# EAGLE design TFTbarebones (EAGLE 9.6.2)
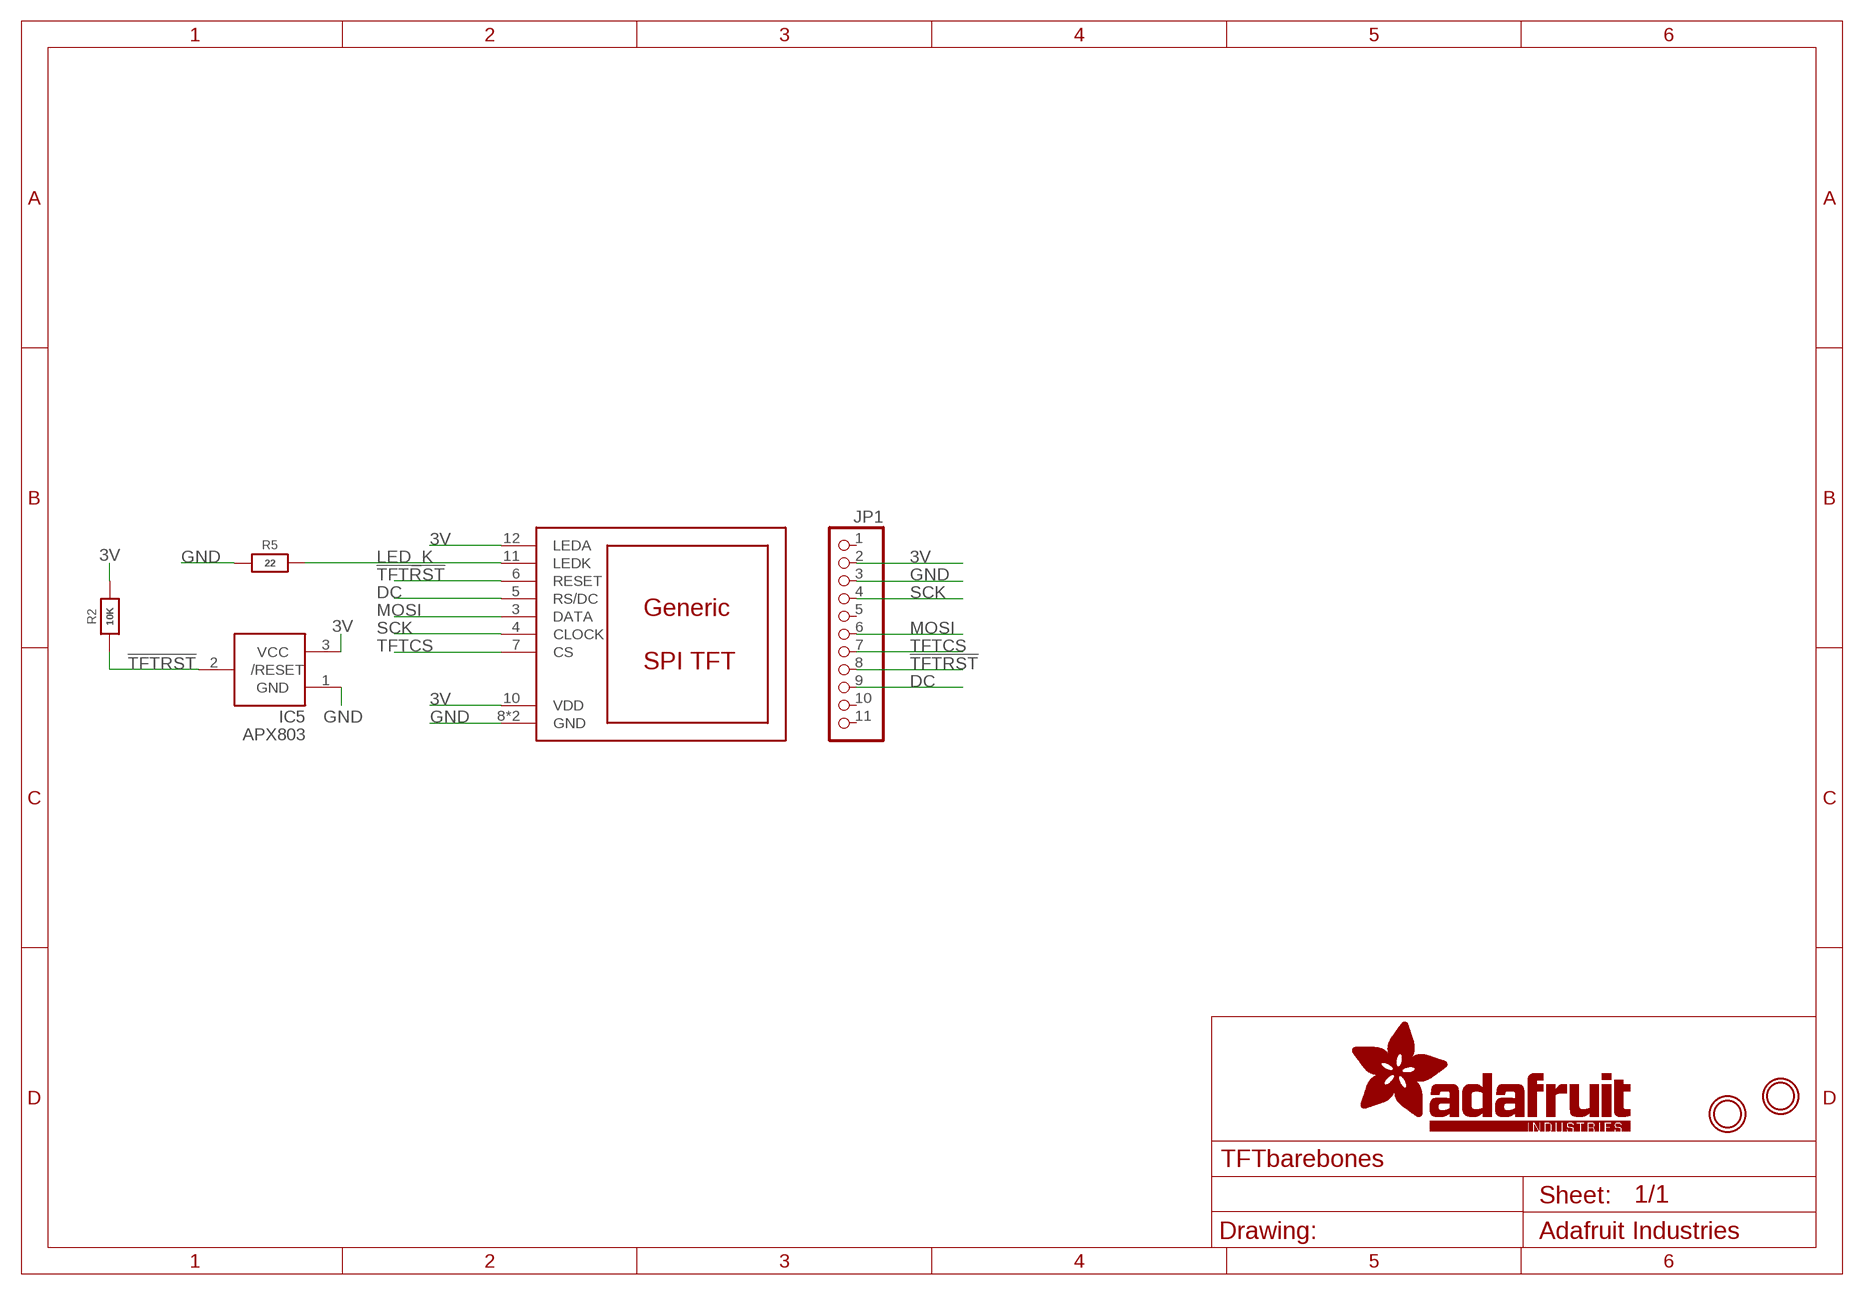
[diagram p0: schematic, sheet 1]

## Parts
DISP1  DISP_LCD_GENERIC_SPI_1.14IN_240X135_WRAPUNDER  [TFT_1.14IN_240X135_WRAPUNDER]
IC5  APX803  AXP083-SAG  [SOT23]
JP1  HEADER-1X11  [1X11_ROUND]
R2  10K  RESISTOR_0603_NOOUT  [0603-NO]
R5  22  RESISTOR_0603_NOOUT  [0603-NO]
U$9  MOUNTINGHOLE2.5  [MOUNTINGHOLE_2.5_PLATED]
U$10  MOUNTINGHOLE2.5  [MOUNTINGHOLE_2.5_PLATED]

## Nets
3V: DISP1.10(VDD) DISP1.12(LEDA) IC5.3(VCC) JP1.2 R2.2
!TFTRST: DISP1.6(RESET) IC5.2(/RESET) JP1.8 R2.1
DC: DISP1.5(RS/DC) JP1.9
GND: DISP1.8(GND) DISP1.13(GND) IC5.1(GND) JP1.3 R5.1
LED_K: DISP1.11(LEDK) R5.2
MOSI: DISP1.3(DATA) JP1.6
SCK: DISP1.4(CLOCK) JP1.4
TFTCS: DISP1.7(CS) JP1.7
Unconnected: JP1.1 JP1.5 JP1.10 JP1.11

## Library data of the parts
DISP1 = microbuilder:DISP_LCD_GENERIC_SPI
IC5 = adafruit:AXP083
JP1 = microbuilder:HEADER-1X11
R2 R5 = microbuilder:RESISTOR: Resistors For new designs, use the packages preceded by an '_' character since they are more reliable: The following footprints should be used on most boards: _0402 - Standard footprint for regular board layouts _0603 - Standard footprint for regular board layouts _0805 - Standard footprint for regular board layouts _1206 - Standard footprint for regular board layouts For extremely tight-pitch boards where space is at a premium, the following 'micro-pitch' footprints can be used (smaller pads, no silkscreen outline, etc.): _0402MP - Micro-pitch footprint for very dense/compact boards _0603MP - Micro-pitch footprint for very dense/compact boards _0805MP - Micro-pitch footprint for very dense/compact boards _1206MP - Micro-pitch footprint for very dense/compact boards
U$9 U$10 = microbuilder:MOUNTINGHOLE: Mounting Hole For #2 screws (0.086"/2.18mm width, 0.094"/2.4mm hole) use 2.5mm; BOM: EXCLUDE

## Board
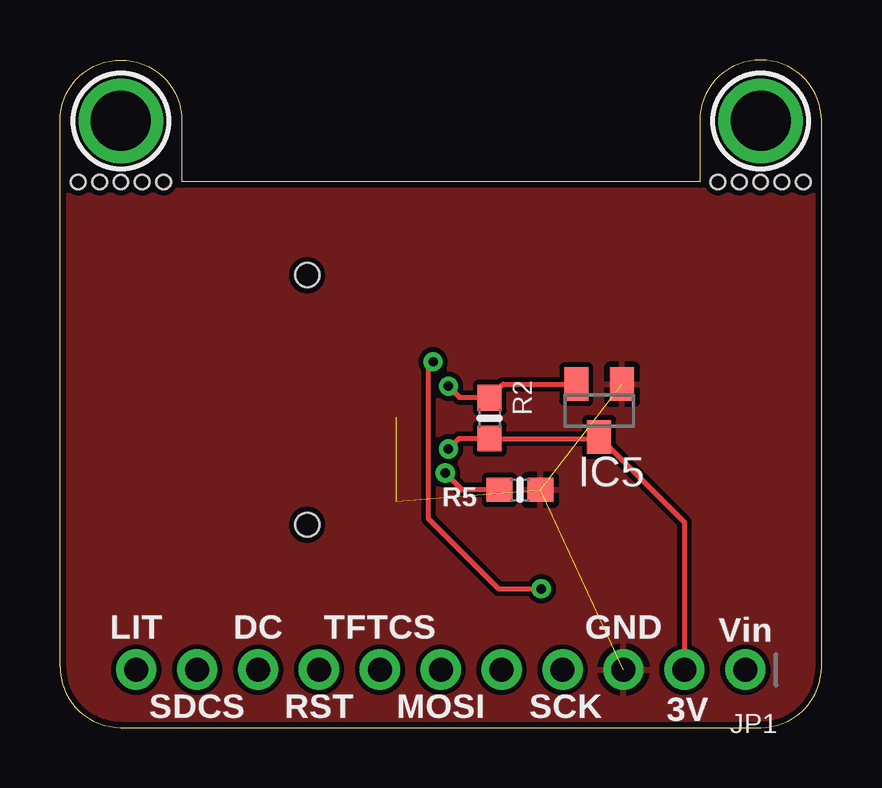
[diagram p1: board, top side]
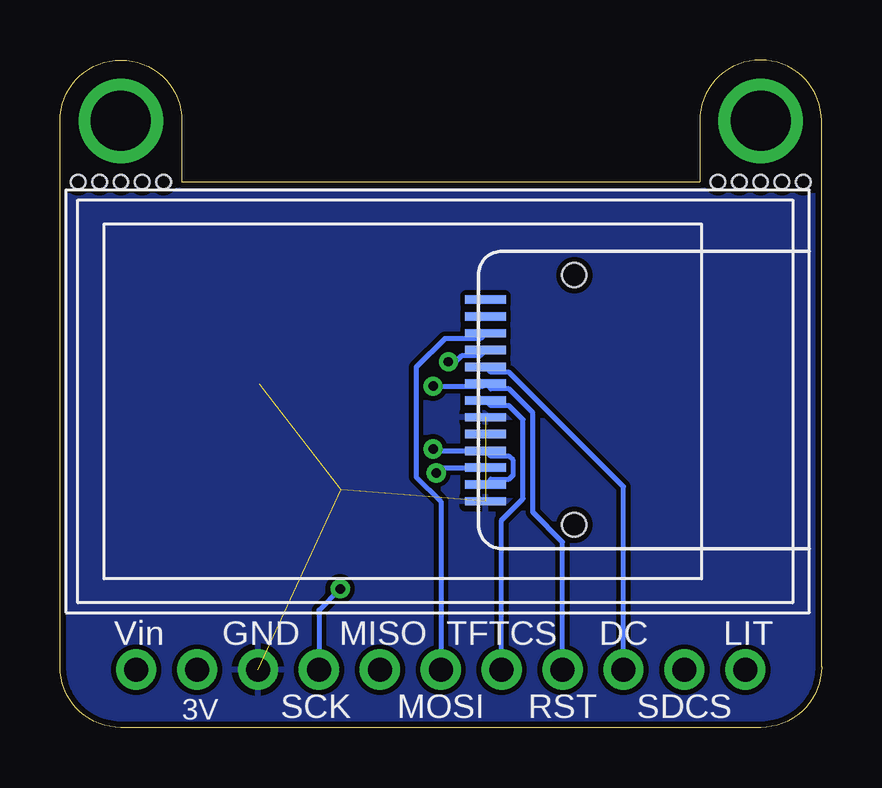
[diagram p2: board, bottom side, seen from below]

Size 31.75 x 27.81 mm. Coordinates in mm from the lower left corner, seen from the top.
Outline: 0,2.54 0,25.27 arc-90 2.54,27.81 arc-90 5.08,25.27 5.08,22.73 26.67,22.73 26.67,25.27 arc-90 29.21,27.81 arc-90 31.75,25.27 31.75,2.54 arc-90 29.21,0 2.54,0 arc-90 0,2.54
Copper layers (1*16): Top 0.035mm / dielectric 1.5mm / Bottom 0.035mm
Design rules "adafruit *": minimum track width 8mil, minimum drill 15.5mil, track to track 8mil, track to pad 8mil, pad to pad 8mil, via to via 8mil, smd to smd 8mil, copper to edge 10mil, drill to drill 8mil, minimum pad ring 10mil, minimum via ring 8mil, stop-mask expansion 2mil, vias tented up to drill 20mil, thermal gap 10mil
Holes 0.6 mm at 4.32,22.73 3.43,22.73 2.54,22.73 1.65,22.73 0.76,22.73 30.99,22.73 30.1,22.73 29.21,22.73 28.32,22.73 27.43,22.73

### Footprints (pad centres in the part's own frame; a part is rotated, then mirrored left to right if it is on the bottom)
TFT_1.14IN_240X135_WRAPUNDER = smd 0.35 x 1.7: 1 4.24,13.5; 2 3.54,13.5; 3 2.84,13.5; 4 2.14,13.5; 5 1.44,13.5; 6 0.74,13.5; 7 0.04,13.5; 8 -0.66,13.5; 9 -1.36,13.5; 10 -2.06,13.5; 11 -2.76,13.5; 12 -3.46,13.5; 13 -4.16,13.5 | hole 1: -5.14,9.8; 5.26,9.8
SOT23 = smd 1 x 1.4: 1 -0.95,-1.1; 2 0.95,-1.1; 3 0,1.1
1X11_ROUND = drill 1 pad 1.676: 1 -12.7,0; 2 -10.16,0; 3 -7.62,0; 4 -5.08,0; 5 -2.54,0; 6 0,0; 7 2.54,0; 8 5.08,0; 9 7.62,0; 10 10.16,0; 11 12.7,0
0603-NO = smd 1.075 x 1: 1 -0.85,0; 2 0.85,0
MOUNTINGHOLE_2.5_PLATED = drill 2.5 pad 3.2: P$1 0,0

### Placement (x,y rotation side)
DISP1  0.51,13.59 90 bottom
IC5  22.48,13.21 180 top
JP1  15.88,2.41 180 top
R2  17.91,12.89 270 top
R5  19.18,9.91 180 top
U$9  2.54,25.27 0 top
U$10  29.21,25.27 0 top

### Tracks (layer width: path | path; a pad name or v marks a point on that pad's centre or on a via)
3V  (via drill 0.39)
  Top 0.203: v16.19,11.61 16.62,12.04 R2.2 22.41,12.04 IC5.3 26.04,8.55 JP1.2
  Bottom 0.203: v16.19,11.61 16.11,11.53 DISP1.10 13.79,11.31 13.03,11.31 12.85,11.13 12.85,10.53 13.03,10.35 13.79,10.35 DISP1.12
!TFTRST  (via drill 0.39)
  Top 0.203: v16.19,14.22 16.68,13.74 R2.1 18.48,14.31 IC5.2
  Bottom 0.203: v16.19,14.22 14.11,14.22 DISP1.6 13.79,14.11 13.03,14.11 12.04,13.12 12.04,8.97 10.8,7.73 JP1.8
DC
  Bottom 0.203: DISP1.5 13.79,14.81 13.03,14.81 8.25,10.03 JP1.9
GND  (4 unrouted)
  pour Top: 31.75,22.61 0.13,22.61 0.13,0.13 31.75,0.13
  pour Bottom: 31.75,22.61 0.13,22.61 0.13,0.13 31.75,0.13
LED_K  (via drill 0.39)
  Top 0.203: R5.2 16.76,9.91 v16.07,10.6
  Bottom 0.203: v16.07,10.6 15.84,10.83 DISP1.11
MOSI
  Bottom 0.203: DISP1.3 14.23,16.21 15.7,16.21 16.9,15.02 16.9,10.44 15.88,9.42 JP1.6
SCK  (via drill 0.39)
  Top 0.203: v20.07,5.78 18.29,5.78 15.36,8.71 15.36,15.04 v15.56,15.24
  Bottom 0.203: v20.07,5.78 20.96,4.89 JP1.4 | DISP1.4 14.23,15.51 14.98,15.51 15.25,15.24 v15.56,15.24
TFTCS
  Bottom 0.203: DISP1.7 13.79,13.41 13.03,13.41 12.45,12.82 12.45,9.53 13.34,8.65 JP1.7

### Text on the board
tPlace: LIT | DC | TFTCS | GND | Vin | SDCS | RST | MOSI | SCK | 3V
bPlace: LIT | DC | TFTCS | MISO | GND | Vin | SDCS | RST | MOSI | SCK | 3V